# Altium schematic sheet Servo.SchDoc
size A4; SheetNumber: 1; SheetTotal: 1
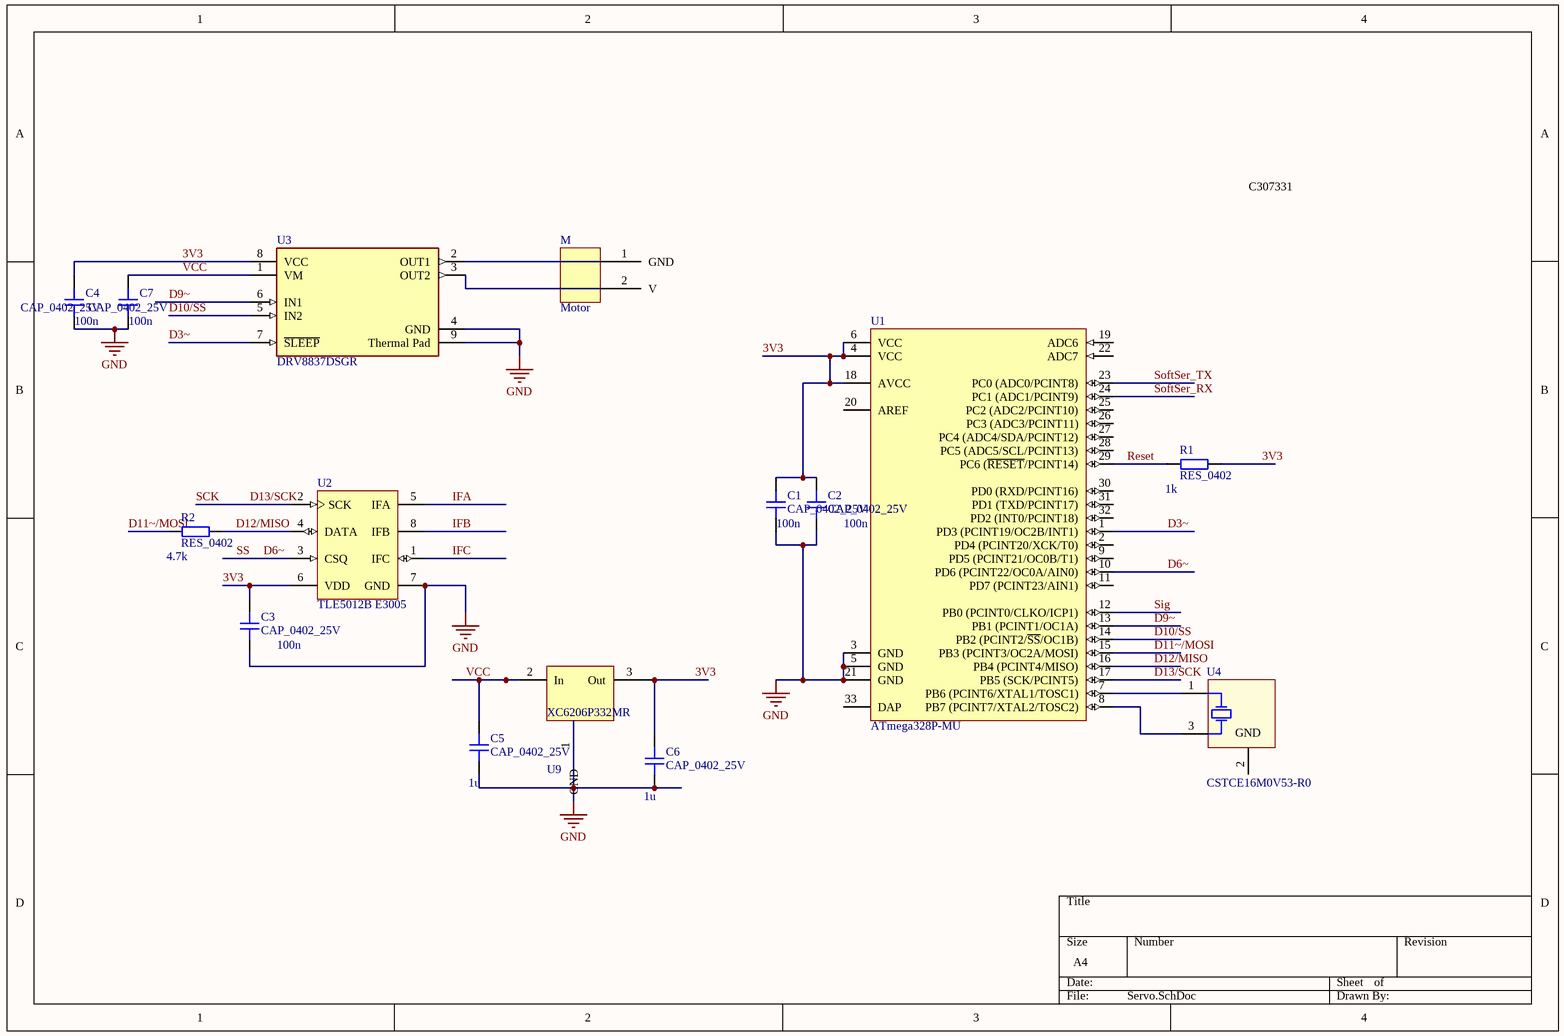
[diagram p0: Servo.SchDoc]

## Parts
C1  CAP_0402_25V  value 100n  [CAP_0402]
C2  CAP_0402_25V  value 100n  [CAP_0402]
C3  CAP_0402_25V  value 100n  [CAP_0402]
C4  CAP_0402_25V  value 100n  [CAP_0402]
C5  CAP_0402_25V  value 1u  [CAP_0402]
C6  CAP_0402_25V  value 1u  [CAP_0402]
C7  CAP_0402_25V  value 100n  [CAP_0402]
M  Motor  [PCBComponent_1]
R1  RES_0402  value 1k  [RES_0402]
R2  RES_0402  value 4.7k  [RES_0402]
U1  ATmega328P-MU  [32M1-A_L]
U2  TLE5012B E3005  [INF-PG-DSO-8-16_N]
U3  DRV8837DSGR  [FP-DSG0008A-MFG]
U4  CSTCE16M0V53-R0  [MURA-CSTCE_V-3_V]
U9  XC6206P332MR  [SOT23-3]

## Nets
GND: C1.1 C2.1 C3.1 C4.1 C5.1 C6.1 C7.1 U1.3(GND) U1.5(GND) U1.21(GND) U2.7(GND) U3.4(GND) U3.9(Thermal_Pad) U9.1(GND)
3V3: C1.2 C2.2 C3.2 C4.2 C6.2 R1.2 U1.4(VCC) U1.6(VCC) U1.18(AVCC) U2.6(VDD) U3.8(VCC) U9.3(Out)
D3~: U1.1(PD3_(PCINT19/OC2B/INT1)) U3.7(~{SLEEP})
D6~: U1.10(PD6_(PCINT22/OC0A/AIN0)) U2.3(CSQ)  [also labelled SS]
D9~: U1.13(PB1_(PCINT1/OC1A)) U3.6(IN1)
D10/SS: U1.14(PB2_(PCINT2/~{SS}/OC1B)) U3.5(IN2)
D11~/MOSI: R2.1 U1.15(PB3_(PCINT3/OC2A/MOSI))
D12/MISO: R2.2 U1.16(PB4_(PCINT4/MISO)) U2.4(DATA)
D13/SCK: U1.17(PB5_(SCK/PCINT5)) U2.2(SCK)  [also labelled SCK]
IFA: U2.5(IFA)
IFB: U2.8(IFB)
IFC: U2.1(IFC)
Reset: R1.1 U1.29(PC6_(~{RESET}/PCINT14))
Sig: U1.12(PB0_(PCINT0/CLKO/ICP1))
SoftSer_RX: U1.24(PC1_(ADC1/PCINT9))
SoftSer_TX: U1.23(PC0_(ADC0/PCINT8))
VCC: C5.2 C7.2 U3.1(VM) U9.2(In)
NetM_1: M.1(GND) U3.2(OUT1)
NetM_2: M.2(V) U3.3(OUT2)
NetU1_7: U1.7(PB6_(PCINT6/XTAL1/TOSC1)) U4.1(C1)
NetU1_8: U1.8(PB7_(PCINT7/XTAL2/TOSC2)) U4.3(C2)

Not connected (* = marked no-connect by the designer): U1 2(PD4_(PCINT20/XCK/T0)) 9(PD5_(PCINT21/OC0B/T1)) 11(PD7_(PCINT23/AIN1)) 19(ADC6) 20(AREF) 22(ADC7) 25(PC2_(ADC2/PCINT10)) 26(PC3_(ADC3/PCINT11)) 27(PC4_(ADC4/SDA/PCINT12)) 28(PC5_(ADC5/SCL/PCINT13)) 30(PD0_(RXD/PCINT16)) 31(PD1_(TXD/PCINT17)) 32(PD2_(INT0/PCINT18)) 33(DAP); U4 2(GND)

## Notes on the sheet
- C307331

## Library data of the parts
C1-C7 = CMP-004-000008-2: Capacitor SMD 0402 25V; Source: Schematic-Lib-PhilsLab.SchLib; Design Item ID: CAP_0402_25V
  C1: JLC: C307331; Parameter 1: *
  C2-C4 C7: JLC: C307331
  C5 C6: JLC: C52923
M = Motor: Existing servo dc motor
R1 R2 = CMP-015-000001-1: Resistor SMD 0402; Source: Schematic-Lib-PhilsLab.SchLib; Design Item ID: RES_0402
  R1: JLC: C11702
  R2: JLC: C25900
U1 = CMP-0095-00077-2: 8-bit AVR Microcontroller, 32KB Flash, 1KB EEPROM, 2KB SRAM, 32-pin MLF, Industrial Grade (-40°C to 85°C); PackageReference: 32M1-A; ComponentLink2URL: http://www.atmel.com/dyn/resources/prod_documents/8271.pdf; DatasheetVersion: revD, May-2011; PackageVersion: revE, May-2006; ComponentLink3URL: http://www.atmel.com/dyn/resources/prod_documents/8271S.pdf; ComponentLink1URL: http://www.atmel.com/; PackageDescription: 32-Pin Micro Lead Frame Package (MLF),  5 x 5 x 1.0 mm Body, Pitch 0.50 mm, 3.10mm Exposed Pad; Code_JEDEC: MO-220-VHHD-2; RevisionNote: DatasheetVersion updated. URLs added.; ComponentLink1Description: Manufacturer URL; ComponentLink3Description: ATmega48A/48PA/88A/88PA/168A/168PA/328/328P Summary; ComponentLink2Description: ATmega48A/48PA/88A/88PA/168A/168PA/328/328P Datasheet; JLC: C7499261
U2 = CMP-1135-00008-1: GMR-Based Angle Sensor, PG-DSO-8-16, Reel, Green; Manufacturer: Infineon; Green: TRUE; Interface: SPI, HSM; ComponentLink3Description: Package Specification; PartNumber: TLE5012B E3005; PackageReference: PG-DSO-8-16; ComponentLink3URL: http://www.infineon.com/dgdl/TLE7259-2GE_DS_rev12.pdf?folderId=db3a3043163797a6011666d32a0c0de1&fileId=db3a3043163797a6011666d4dbb80de2&location=en.Products.Automotive_ICs.Automotive_Transceivers.LIN_Transceivers.DATASHEET.TLE7259-2GE_DS_rev12.pdf; Halogen-free: available; Packing: Reel; PackageVersion: Mar-07; PackageDescription: 8-Pin Plastic (Green) Dual Small Outline Package, 4.9 x 3.9 mm Body, 1.27 mm Pitch; ComponentLink2URL: http://www.infineon.com/dgdl/TLE5012B_FDS_Rev1+1.pdf?folderId=db3a30431ce5fb52011d3dd6e8012582&fileId=db3a304334fac4c601350f31c43c433f; ComponentLink2Description: Datasheet; ComponentLink1Description: Manufacturer URL; DatasheetVersion: Rev. 1.1; ComponentLink1URL: http://www.infineon.com/; Mounting Technology: Surface Mount
U3 = CMP-04915-000004-1: IC MOTOR DRIVER PAR 8WSON; Manufacturer: Texas Instruments; Switching Frequency: 0-250kHz; Min Supply Voltage: 1.8V; Standoff Height: 0mm; Max Supply Voltage: 7V; Output Voltage: 0-11V; Motor Type: Brushed; Number Of Outputs: 2; Output Current: 1.8A; Max Junction Temp: +150°C; Nominal Supply Current: 300-700uA; Mouser Description: Motor / Motion / Ignition Controllers & Drivers 1.8A Low Vltg Brush DC Motor Driver; Device Class L2: Power Management ICs; Manufacturer Part Number: DRV8837DSGR; Temperature Range Low: -40°C; Lead Free: Yes; Height: 0.8mm; Device Class L3: Motor Drivers; Octopart: https://octopart.com/drv8837dsgr-texas+instruments-23786726; Package: DSG0008A; ComponentLink2URL: http://www.ti.com/lit/ds/symlink/drv8837.pdf; Temperature: -40°C to +85°C; Ambient Temperature Range Low: -40°C; ComponentLink2Description: Datasheet; Ambient Temperature Range High: +85°C; Device Class L1: Integrated Circuits (ICs); Category: IC; Temperature Range High: +85°C; RoHS: TRUE; Automotive: No; Digikey Description: IC MOTOR DRIVER PAR 8WSON; JLC: C39159
U4 = CMP-0588-00001-2: Ceramic Resonator, 16 MHz with Built-in Capacitance, Thickness Expander Mode, Initial Frequency Tolerance +/- 0.5%, Load Capacity 15 pF, -20 to 80 degC, 3.2 x 1.3 x 1 mm SMD, RoHS, Reel; Manufacturer: Murata; Oscillating Frequency: 16 MHz; Load Capacity: 15 pF; PackageDescription: 3-Pin SMD, Body 3.2 x 1.3 mm, Pitch 0.95 mm; Mounting Technology: Surface Mount; ComponentLink1URL: http://www.murata.com/; RoHS: TRUE; Packing: Reel; Initial Frequency Tolerance: +/- 0.5%; PartNumber: CSTCE16M0V53-R0; ComponentLink2Description: Datasheet; DatasheetVersion: Rev. P16E-22; PackageReference: CSTCE_V-3; Operating Temperature Range: -20 to 80 degC; ComponentLink2URL: http://www.murata.com/products/catalog/pdf/p16e.pdf; ComponentLink1Description: Manufacturer URL; Initial Tolerance: +/- 0.5%; JLC: C32180
U9 = XC6206P332MR: JLC: C5446